# Altium project SpaceLiin_Satellite_4U_Laser_Internal_External_V1.0.0.PrjPcb
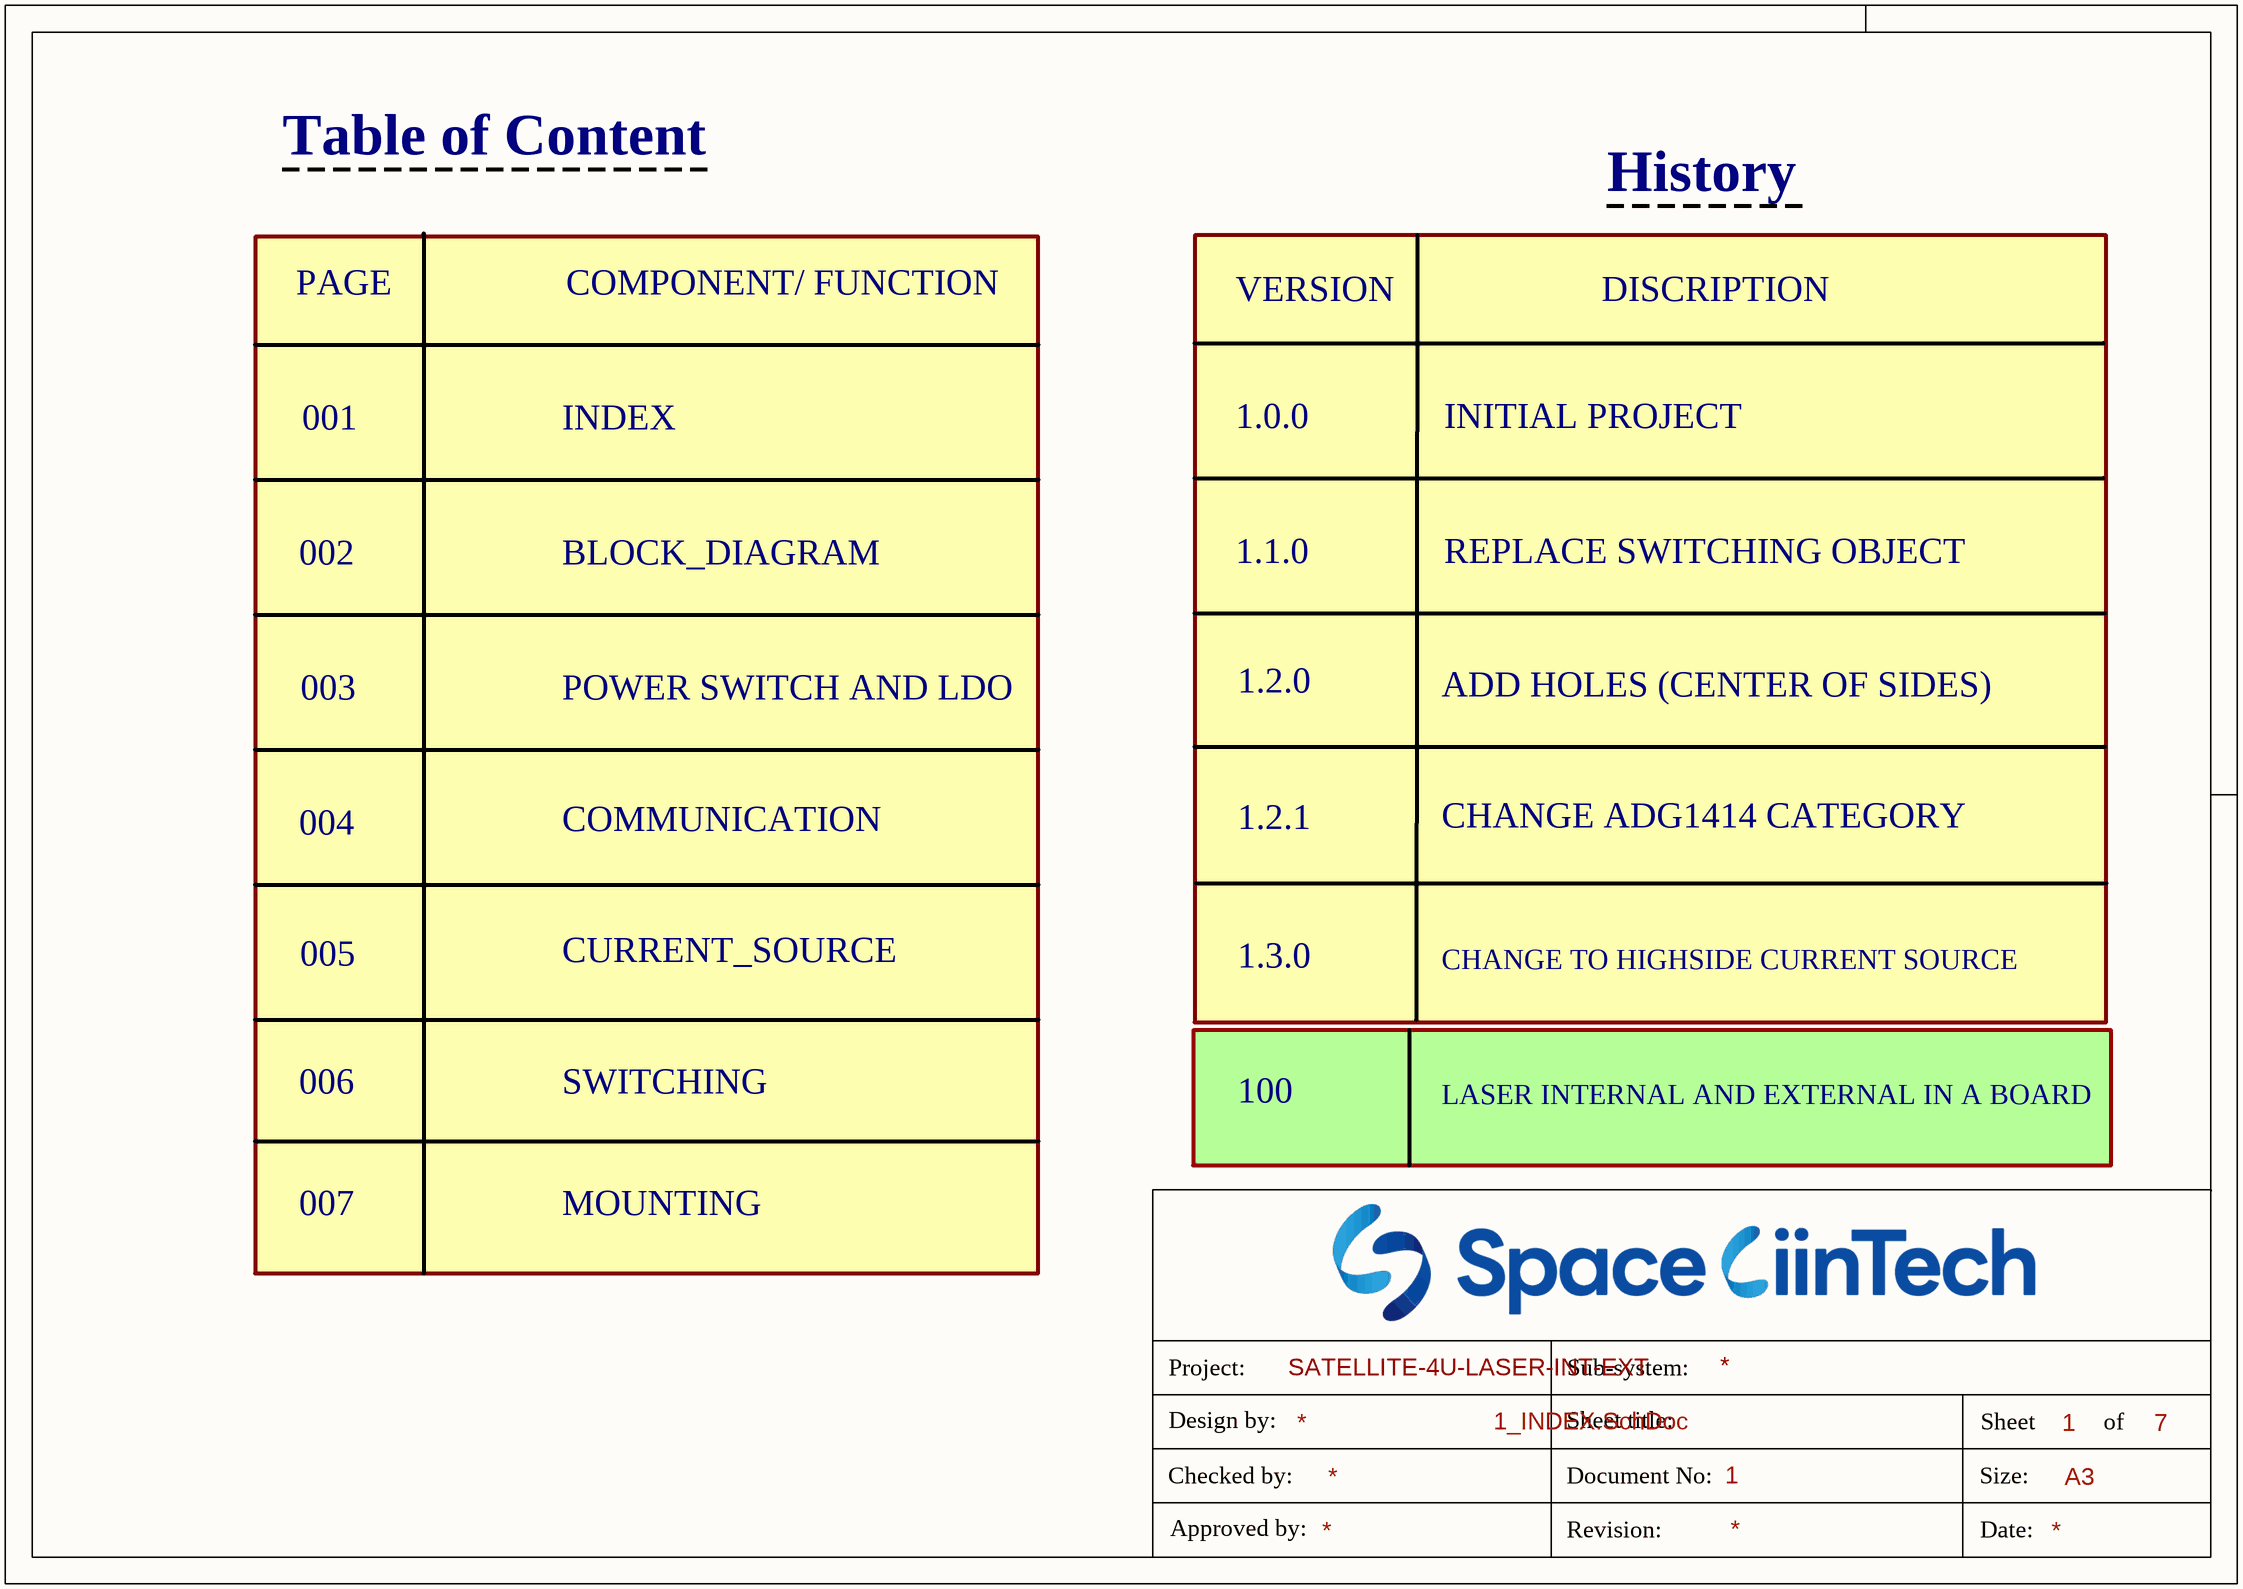
[diagram p0: 1_INDEX.SchDoc]
7 sheets, 210 parts. Net scope: global (net labels, ports and power ports of the same name join across sheets).
Board files: LASER.PcbDoc, SpaceLiin_Satellite_4U_Laser_Internal_External_V1.0.0.PcbDoc
Sheets:
  1_INDEX.SchDoc
  2_BLOCK_DIAGRAM.SchDoc
  3_POWER SWITCH AND LDO.SchDoc
  4_COMMUNICATION.SchDoc
  5_CURRENT_SOURCE.SchDoc
  6_SWITCHING.SchDoc
  MOUNTING.SchDoc

## Sheet 1_INDEX.SchDoc
size 420 x 297 mm; SheetNumber: 1; SheetTotal: 7; Project: SATELLITE-4U-LASER-INT-EXT

### Notes on the sheet
- Table of Content
- History
- PAGE
- COMPONENT/ FUNCTION
- VERSION
- DISCRIPTION
- 001
- INDEX
- 1.0.0
- INITIAL PROJECT
- 002
- BLOCK_DIAGRAM
- 1.1.0
- REPLACE SWITCHING OBJECT
- 003
- POWER SWITCH AND LDO
- 1.2.0
- ADD HOLES (CENTER OF SIDES)
- 004
- COMMUNICATION
- 1.2.1
- CHANGE ADG1414 CATEGORY
- 005
- CURRENT_SOURCE
- 1.3.0
- CHANGE TO HIGHSIDE CURRENT SOURCE
- 006
- SWITCHING
- 100
- LASER INTERNAL AND EXTERNAL IN A BOARD
- 007
- MOUNTING
- Project:
- Sub-system:
- Design by:
- Sheet title:
- Sheet
- A3
- of
- Checked by:
- Approved by:
- Revision:
- Document No:
- Size:
- Date:

## Sheet 2_BLOCK_DIAGRAM.SchDoc
size 420 x 297 mm; SheetNumber: 2; SheetTotal: 7

### Notes on the sheet
- Project:
- Sub-system:
- Design by:
- Sheet title:
- Sheet
- A3
- of
- Checked by:
- Approved by:
- Revision:
- Document No:
- Size:
- Date:

## Sheet 3_POWER SWITCH AND LDO.SchDoc
size 420 x 297 mm; SheetNumber: 3; SheetTotal: 7
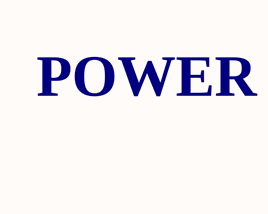
[diagram p1: 3_POWER SWITCH AND LDO.SchDoc, top left]
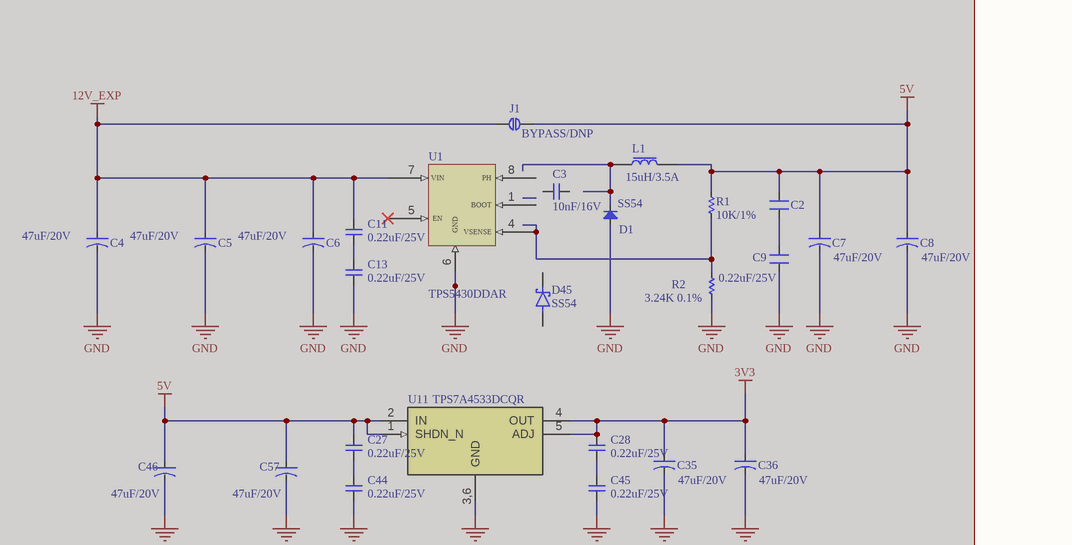
[diagram p2: 3_POWER SWITCH AND LDO.SchDoc, top right]
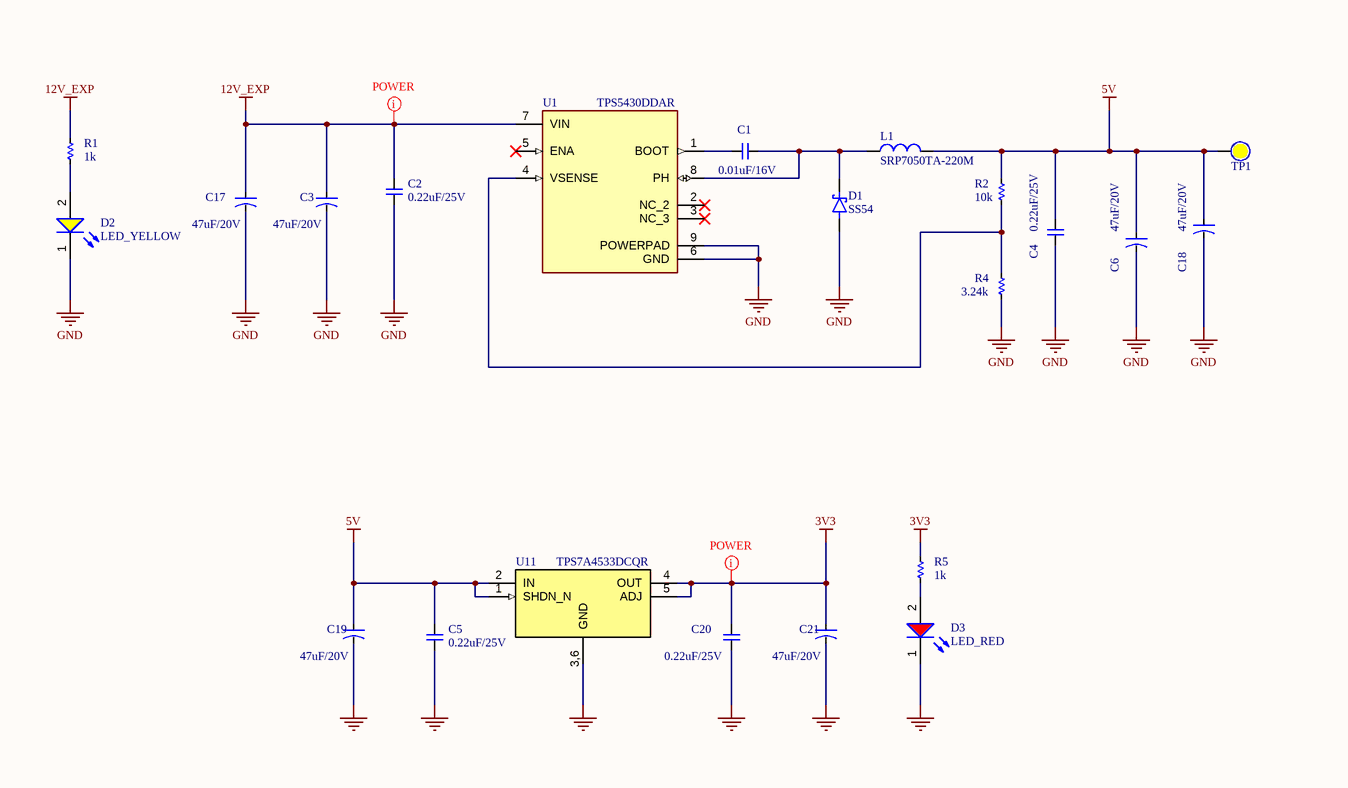
[diagram p3: 3_POWER SWITCH AND LDO.SchDoc, bottom right]

### Parts
(Parts that share a designator on the sheet are numbered #1, #2 ... from top to bottom, then left to right.)
C1  0.01uF/16V  [CAP_C_1608X80]
C2#1  0.22uF/25V  [SM-0603]  (value not drawn)  (masked out: inside a compile mask, not in the netlist)
C2#2  0.22uF/25V  [CAP_C_1608X80]
C3#1  10nF/16V  [CAP_C_1608X80]  (masked out: inside a compile mask, not in the netlist)
C3#2  47uF/20V  [CAP TANT 2312]
C4#1  47uF/20V  [CAP TANT 2312]  (masked out: inside a compile mask, not in the netlist)
C4#2  0.22uF/25V  [CAP_C_1608X80]
C5#1  47uF/20V  [CAP TANT 2312]  (masked out: inside a compile mask, not in the netlist)
C5#2  0.22uF/25V  [CAP_C_1608X80]
C6#1  47uF/20V  [CAP TANT 2312]  (masked out: inside a compile mask, not in the netlist)
C6#2  47uF/20V  [CAP TANT 2312]
C7  47uF/20V  [CAP TANT 2312]  (masked out: inside a compile mask, not in the netlist)
C8  47uF/20V  [CAP TANT 2312]  (masked out: inside a compile mask, not in the netlist)
C9#1  0.22uF/25V  [SM-0603]  (masked out: inside a compile mask, not in the netlist)
C11  0.22uF/25V  [CAP_C_1608X80]  (masked out: inside a compile mask, not in the netlist)
C13  0.22uF/25V  [CAP_C_1608X80]  (masked out: inside a compile mask, not in the netlist)
C17  47uF/20V  [CAP TANT 2312]
C18  47uF/20V  [CAP TANT 2312]
C19  47uF/20V  [CAP TANT 2312]
C20  0.22uF/25V  [CAP_C_1608X80]
C21  47uF/20V  [CAP TANT 2312]
C27  0.22uF/25V  [CAP_C_1608X80]  (masked out: inside a compile mask, not in the netlist)
C28  0.22uF/25V  [CAP_C_1608X80]  (masked out: inside a compile mask, not in the netlist)
C35  47uF/20V  [CAP TANT 2312]  (masked out: inside a compile mask, not in the netlist)
C36  47uF/20V  [CAP TANT 2312]  (masked out: inside a compile mask, not in the netlist)
C44  0.22uF/25V  [CAP_C_1608X80]  (masked out: inside a compile mask, not in the netlist)
C45  0.22uF/25V  [CAP_C_1608X80]  (masked out: inside a compile mask, not in the netlist)
C46  47uF/20V  [CAP TANT 2312]  (masked out: inside a compile mask, not in the netlist)
C57  47uF/20V  [CAP TANT 2312]  (masked out: inside a compile mask, not in the netlist)
D1#1  SS54  [DIO-SMD-A]  (masked out: inside a compile mask, not in the netlist)
D1#2  SS54  [DO-214AC_SMA]
D2  LED_YELLOW  [LED_0603]
D3  LED_RED  [LED_0603]
D45  SS54  [DO-214AC_SMA]  (masked out: inside a compile mask, not in the netlist)
J1#1  BYPASS/DNP  [BIG_CONNECTOR]  (masked out: inside a compile mask, not in the netlist)
L1#1  15uH/3.5A  [SRP7050TA]  (masked out: inside a compile mask, not in the netlist)
L1#2  SRP7050TA-220M  [PSM6050]
R1#1  10K/1%  [RES-SMD-0603]  (masked out: inside a compile mask, not in the netlist)
R1#2  1k  [RES_C_1005X40]
R2#1  3.24K 0.1%  [RES-SMD-0603]  (masked out: inside a compile mask, not in the netlist)
R2#2  10k  [RES_C_1005X40]
R4  3.24k  [RES_C_1005X40]
R5  1k  [RES_C_1005X40]
TP1  (no value)  [Testpoint_80]  (no BOM)
U1#1  TPS5430DDAR  [HSOP8]  (masked out: inside a compile mask, not in the netlist)
U1#2  TPS5430DDAR  [CONV_TPS5430DDAR]
U11#1  TPS7A4533DCQR  [SOT223-6]  (masked out: inside a compile mask, not in the netlist)
U11#2  TPS7A4533DCQR  [SOT223-6]

### Nets
3V3: C20.2 C21.1 R5.2 U11#2.4(OUT) U11#2.5(ADJ)
5V: C4#2.2 C5#2.2 C6#2.1 C18.1 C19.1 L1#2.2 R2#2.2 TP1.1 U11#2.1(SHDN_N) U11#2.2(IN)
12V_EXP: C2#2.2 C3#2.1 C17.1 R1#2.2 U1#2.7(VIN)
GND: C2#2.1 C3#2.2 C4#2.1 C5#2.1 C6#2.2 C17.2 C18.2 C19.2 C20.1 C21.2 D1#2.2(A) D2.1(K) D3.1(K) R4.1 U1#2.6(GND) U1#2.9(POWERPAD) U11#2.3,6(GND)
NetC1_1: C1.1 D1#2.1(K) L1#2.1 U1#2.8(PH)
NetC1_2: C1.2 U1#2.1(BOOT)
NetD2_2: D2.2(A) R1#2.1
NetD3_2: D3.2(A) R5.1
NetR2#2_1: R2#2.1 R4.2 U1#2.4(VSENSE)

Not connected (* = marked no-connect by the designer): U1#2 2(NC_2)* 3(NC_3)* 5(ENA)*

### Layout directives
net class POWER: 3V3, 12V_EXP

### Notes on the sheet
- POWER SWITCH AND LDO
- Project:
- Sub-system:
- Design by:
- Sheet title:
- Sheet
- A3
- of
- Checked by:
- Approved by:
- Revision:
- Document No:
- Size:
- Date:

### Library data of the parts
C1 C2#2 C3#1 C4#2 C5#2 C11 C13 C20 C27 C28 C44 C45 = _CAP_C_2: CAP
C2#1 C9#1 = CM: CL10B224KA8NNNC; Value: 103
C3#2 C4#1 C5#1 C6#1 C6#2 C7 C8 C17-C19 C21 C35 C36 C46 C57 = CN-ALU-SMD: TAJC476K020RNJ; Published: 8-Jun-2000; LatestRevisionDate: 17-Jul-2002; LatestRevisionNote: Re-released for DXP Platform.; PackageReference: POLAR0.8; Publisher: Altium Limited
D1#1 = Diode SMD: Code - JEDEC: DO-214-AB; Value: 1N5007; Published: 8-Jun-2000; Revision: July-2002: Re-released for DXP Platform.; Publisher: Altium Limited
D1#2 D45 = DIODE SCHOTTKY
J1#1 = CNT: DNP
L1#1 = INDUCTOR: SRP7050TA-150M
L1#2 = SRP7050TA-220M: FIXED IND 22UH 2.5A 170 MOHM SMD
R1#1 = Res-SMD: ERJ-3EKF1002V; Manufacturer: Generic Components; Class: Passive; Published: 08/06/2000; Publisher: Altium Hobart Technology Centre
R1#2 R2#2 R4 R5 = _RES_B_2: RES
R2#1 = Res-SMD: ERJ-3EKF3241V; Manufacturer: Generic Components; Class: Passive; Published: 08/06/2000; Publisher: Altium Hobart Technology Centre
TP1 = Test Point: Solder: NF
U1#1 = TPS543X: pin to pad: 6>6+9
U1#2 = TPS5430DDAR: 5.5V to 36V Input, 3A, 500kHz Step-Down Converter; MF: Texas Instruments; Package: HSOIC-8 Texas Instruments; Check_prices: https://www.snapeda.com/parts/TPS5430DDAR/Texas+Instruments/view-part/?ref=eda; Value: *; Purchase-URL: https://pricing.snapeda.com/search/part/TPS5430DDAR/?ref=eda; Availability: In Stock; SnapEDA_Link: https://www.snapeda.com/parts/TPS5430DDAR/Texas+Instruments/view-part/?ref=snap; MP: TPS5430DDAR; Price: None

## Sheet 4_COMMUNICATION.SchDoc
size 420 x 297 mm; SheetNumber: 4; SheetTotal: 7
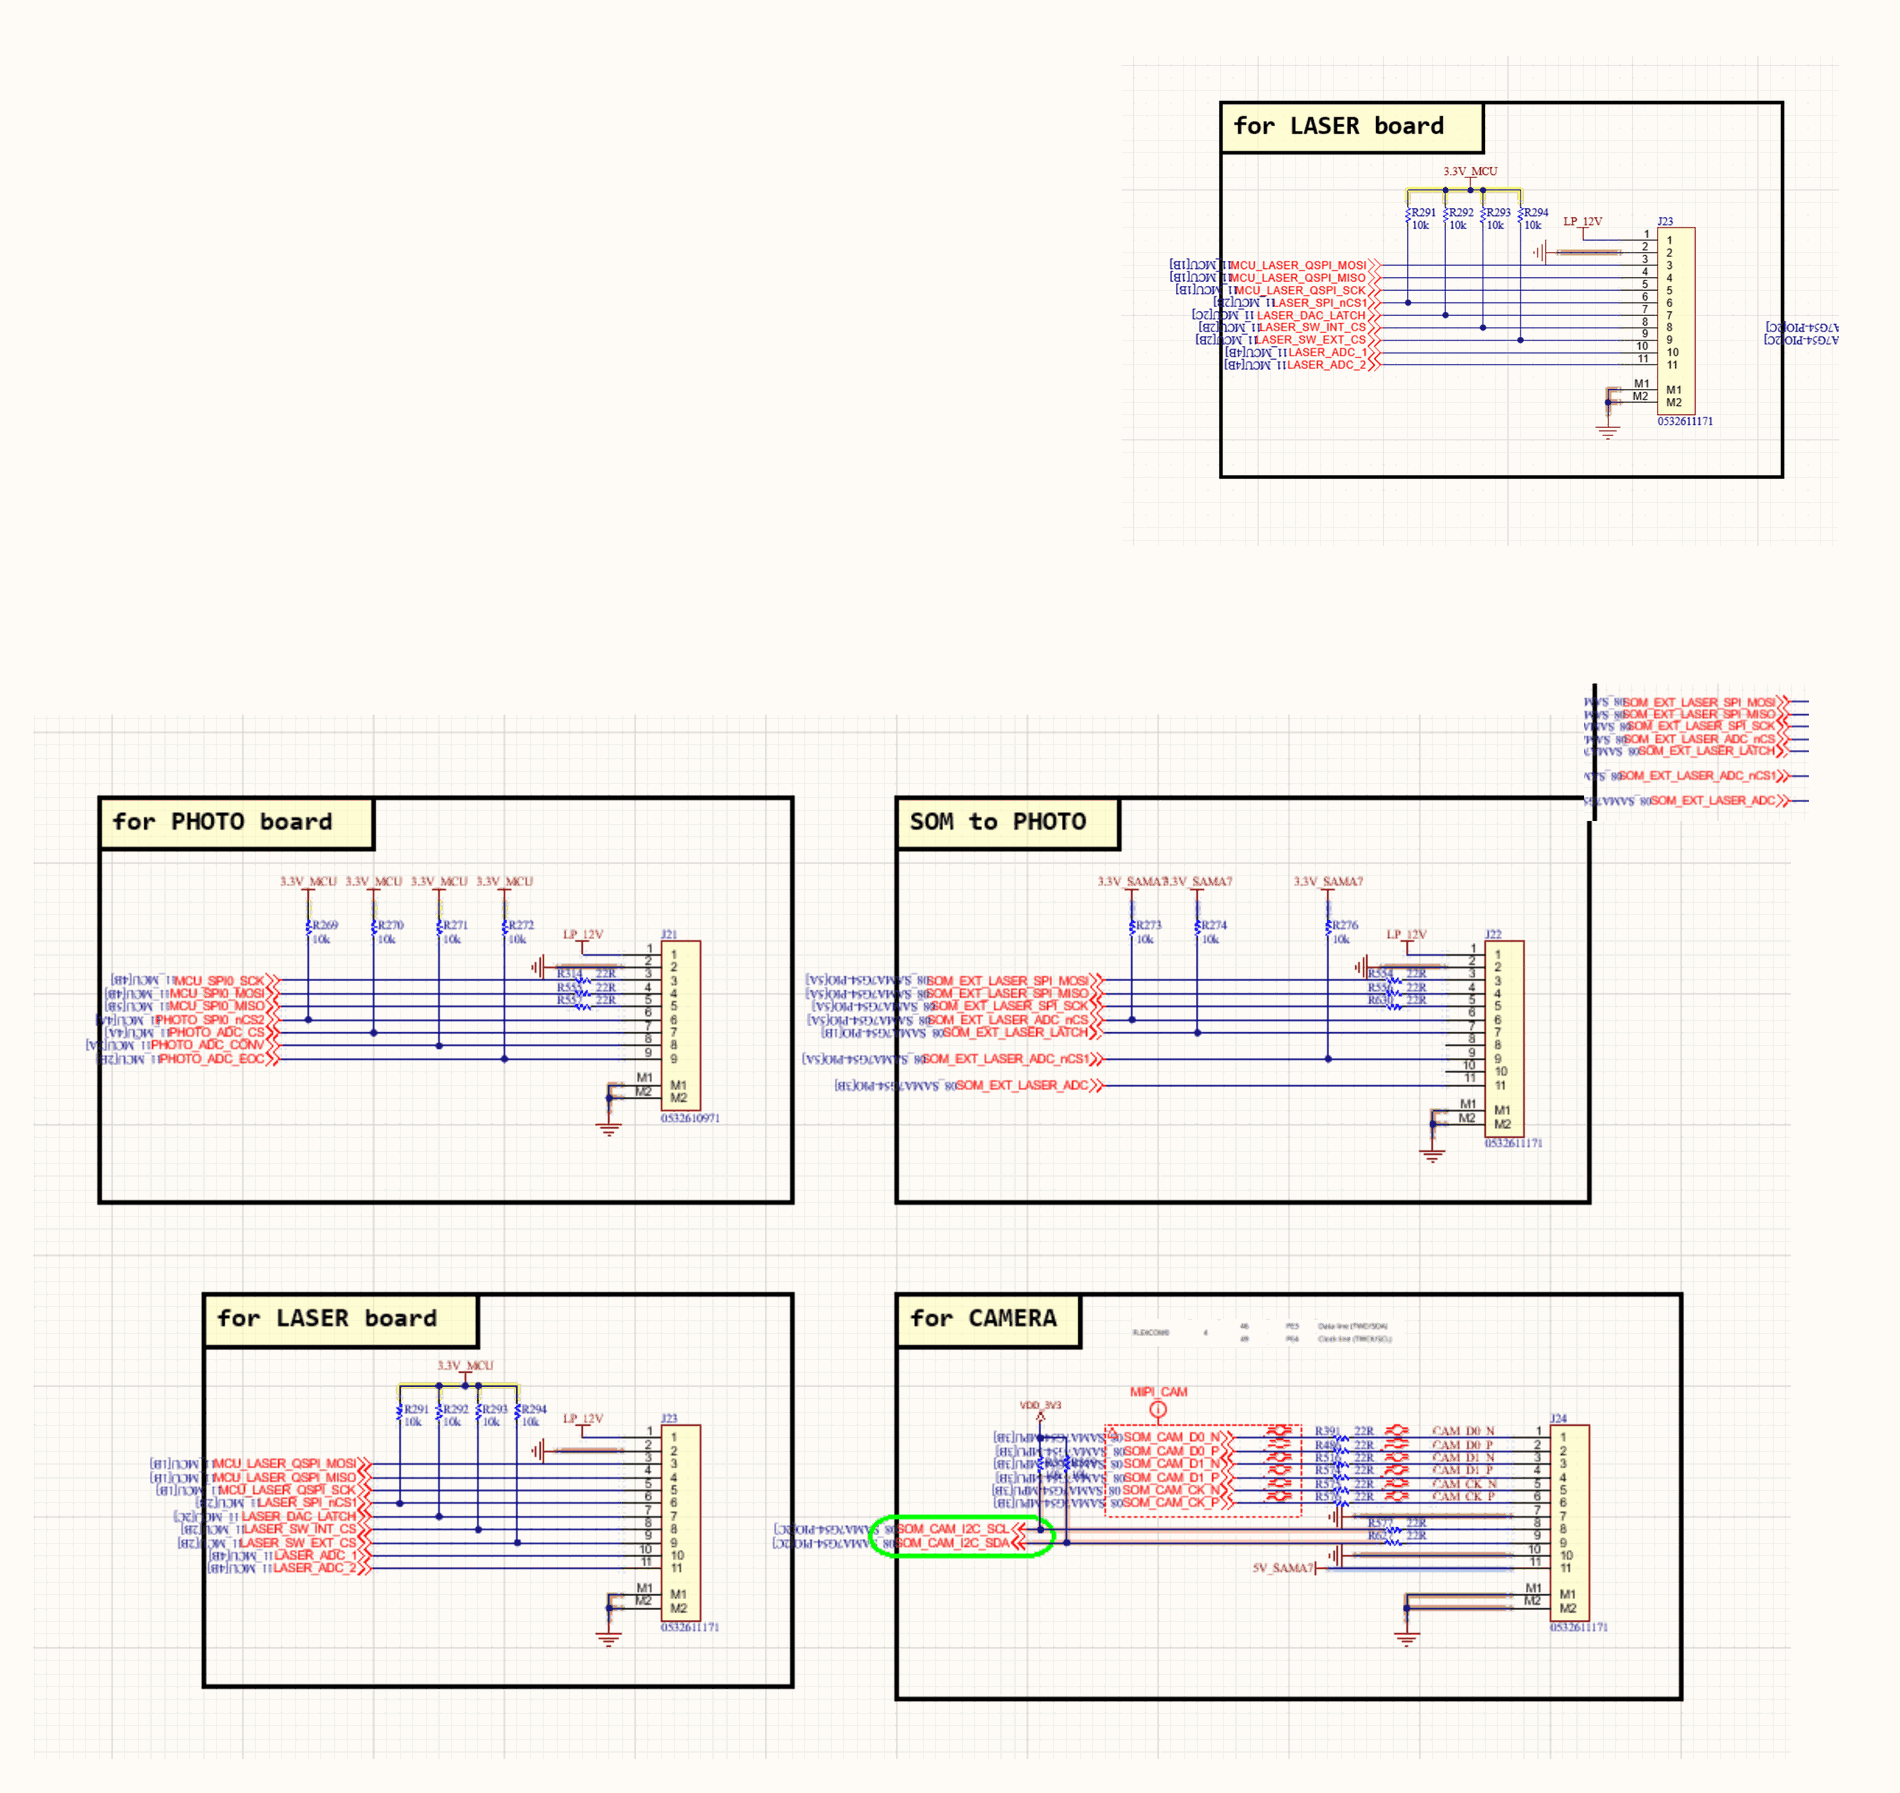
[diagram p4: 4_COMMUNICATION.SchDoc, left]
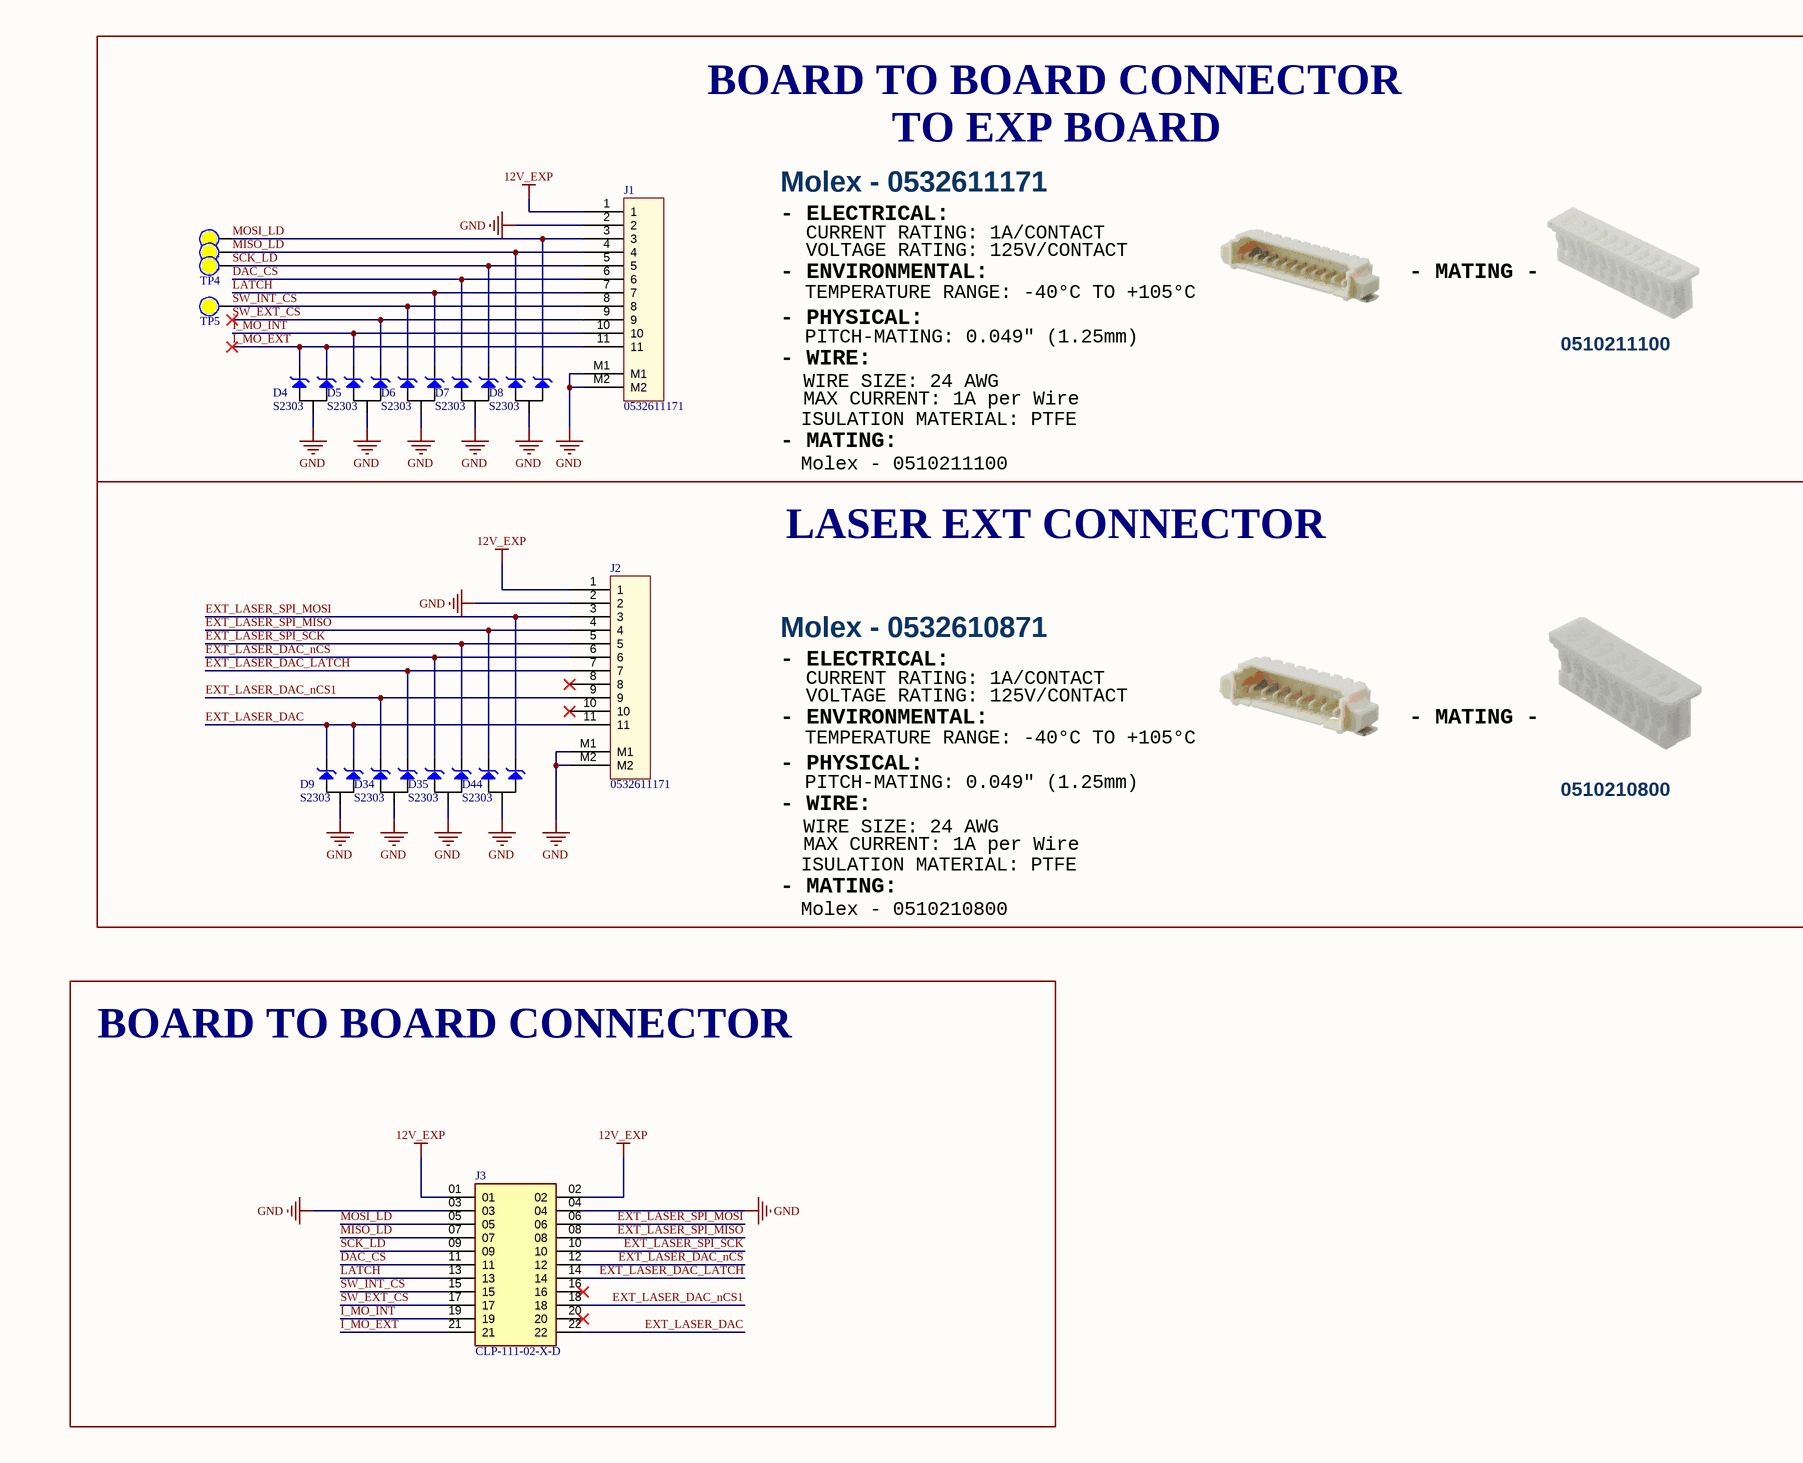
[diagram p5: 4_COMMUNICATION.SchDoc, right]

### Parts
(Parts that share a designator on the sheet are numbered #1, #2 ... from top to bottom, then left to right.)
D4  S2303  [SOT23-3-132]
D5  S2303  [SOT23-3-132]
D6  S2303  [SOT23-3-132]
D7  S2303  [SOT23-3-132]
D8  S2303  [SOT23-3-132]
D9  S2303  [SOT23-3-132]
D34  S2303  [SOT23-3-132]
D35  S2303  [SOT23-3-132]
D44  S2303  [SOT23-3-132]
J1#2  0532611171  [MOLEX_0532611171]
J2  0532611171  [MOLEX_0532611171]
J3  CLP-111-02-X-D  [SAMTEC_CLP-111-02-X-D]
TP2  (no value)  [Testpoint_80]  (no BOM)
TP3  (no value)  [Testpoint_80]  (no BOM)
TP4  (no value)  [Testpoint_80]  (no BOM)
TP5  (no value)  [Testpoint_80]  (no BOM)

### Blocks framed on the sheet
LASER EXT CONNECTOR: D9 D34 D35 D44 J2
BOARD TO BOARD CONNECTOR: J3

### Nets
12V_EXP: J1#2.1 J2.1 J3.01 J3.02
GND: D4.3 D5.3 D6.3 D7.3 D8.3 D9.3 D34.3 D35.3 D44.3 J1#2.2 J1#2.M1 J1#2.M2 J2.2 J2.M1 J2.M2 J3.03 J3.04
DAC_CS: D7.2 J1#2.6 J3.11
EXT_LASER_DAC: D9.1 D9.2 J2.11 J3.22
EXT_LASER_DAC_LATCH: D34.1 J2.7 J3.14
EXT_LASER_DAC_nCS: D35.2 J2.6 J3.12
EXT_LASER_DAC_nCS1: D34.2 J2.9 J3.18
EXT_LASER_SPI_MISO: D44.2 J2.4 J3.08
EXT_LASER_SPI_MOSI: D44.1 J2.3 J3.06
EXT_LASER_SPI_SCK: D35.1 J2.5 J3.10
I_MO_EXT: D4.1 D4.2 J1#2.11 J3.21
I_MO_INT: D5.2 J1#2.10 J3.19
LATCH: D6.1 J1#2.7 J3.13
MISO_LD: D8.2 J1#2.4 J3.07 TP3.1
MOSI_LD: D8.1 J1#2.3 J3.05 TP2.1
SCK_LD: D7.1 J1#2.5 J3.09 TP4.1
SW_EXT_CS: D5.1 J1#2.9 J3.17
SW_INT_CS: D6.2 J1#2.8 J3.15 TP5.1

Not connected (* = marked no-connect by the designer): J2 8* 10*; J3 16* 20*

### Notes on the sheet
- BOARD TO BOARD CONNECTOR
- Molex - 0532611171
- TO EXP BOARD
- - ELECTRICAL:
- - ENVIRONMENTAL:
- CURRENT RATING: 1A/CONTACT
- VOLTAGE RATING: 125V/CONTACT
- - MATING -
- - PHYSICAL:
- TEMPERATURE RANGE: -40°C TO +105°C
- PITCH-MATING: 0.049" (1.25mm)
- - WIRE:
- WIRE SIZE: 24 AWG
- MAX CURRENT: 1A per Wire
- 0510211100
- - MATING:
- ISULATION MATERIAL: PTFE
- Molex - 0510211100
- Molex - 0532610871
- 0510210800
- Molex - 0510210800
- Project:
- Sub-system:
- Design by:
- Sheet title:
- Sheet
- A3
- of
- Checked by:
- Approved by:
- Revision:
- Document No:
- Size:
- Date:

### Library data of the parts
J1#2 J2 = Header 11x1_2M
J3 = CLP-111-02-X-D: CLP - Samtec 1.27mm Tiger Claw Rugged Reliable Dual Wipe Socket Strip; MP: CLP-111-02-L-D; SnapEDA_Link: https://www.snapeda.com/parts/CLP-111-02-L-D/Samtec/view-part/?ref=snap; Package: None; Value: *; MF: Samtec; Check_prices: https://www.snapeda.com/parts/CLP-111-02-L-D/Samtec/view-part/?ref=eda
TP2-TP5 = Test Point: Solder: NF

## Sheet 5_CURRENT_SOURCE.SchDoc
size 420 x 297 mm; SheetNumber: 5; SheetTotal: 7
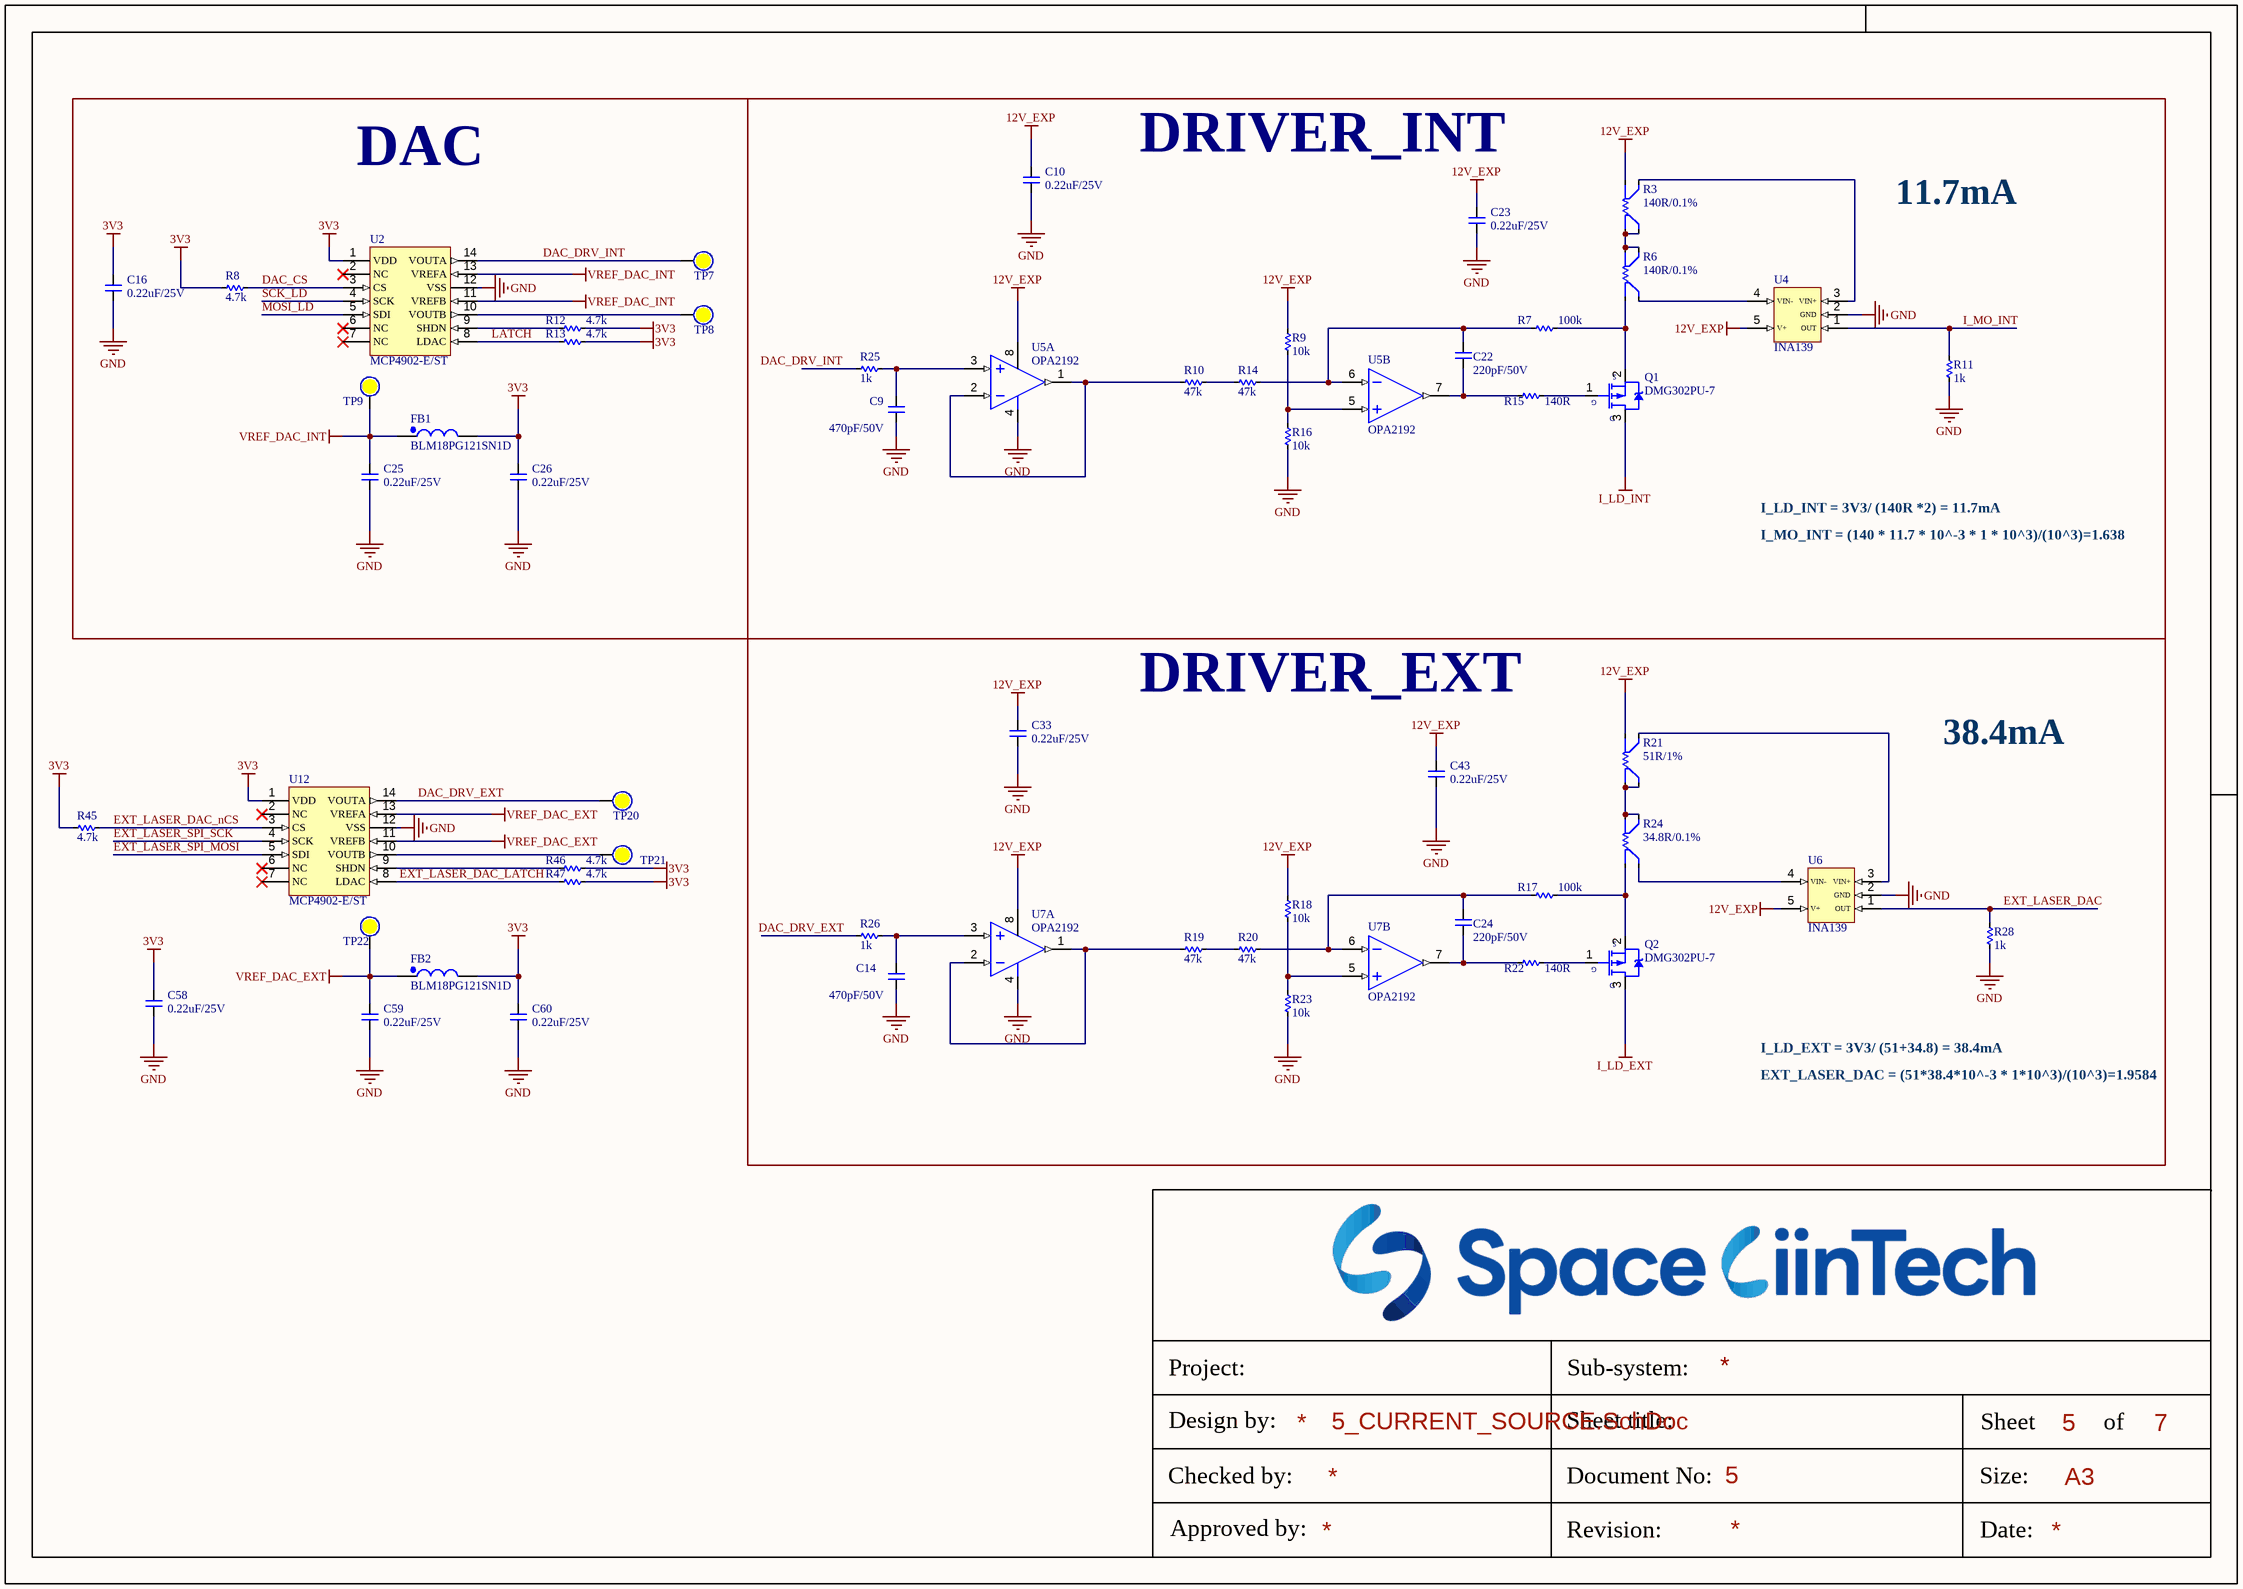
[diagram p6: 5_CURRENT_SOURCE.SchDoc]

### Parts
(Parts that share a designator on the sheet are numbered #1, #2 ... from top to bottom, then left to right.)
C9#2  470pF/50V  [CAP_C_1608X80]
C10  0.22uF/25V  [CAP_C_1608X80]
C14  470pF/50V  [CAP_C_1608X80]
C16  0.22uF/25V  [CAP_C_1608X80]
C22  220pF/50V  [CAP_C_1608X80]
C23  0.22uF/25V  [CAP_C_1608X80]
C24  220pF/50V  [CAP_C_1608X80]
C25  0.22uF/25V  [CAP_C_1608X80]
C26  0.22uF/25V  [CAP_C_1608X80]
C33  0.22uF/25V  [CAP_C_1608X80]
C43  0.22uF/25V  [CAP_C_1608X80]
C58  0.22uF/25V  [CAP_C_1608X80]
C59  0.22uF/25V  [CAP_C_1608X80]
C60  0.22uF/25V  [CAP_C_1608X80]
FB1  BLM18PG121SN1D  [IND_C_1608X60]
FB2  BLM18PG121SN1D  [IND_C_1608X60]
Q1  DMG302PU-7  [SOT23-3-132]
Q2  DMG302PU-7  [SOT23-3-132]
R3  140R/0.1%  [RES_SMD_0603_SHUNT]
R6  140R/0.1%  [RES_SMD_0603_SHUNT]
R7  100k  [RES_C_1608X60]
R8  4.7k  [RES_C_1608X60]
R9  10k  [RES_C_1608X60]
R10  47k  [RES_C_1608X60]
R11  1k  [RES_C_1608X60]
R12  4.7k  [RES_C_1608X60]
R13  4.7k  [RES_C_1608X60]
R14  47k  [RES_C_1608X60]
R15  140R  [RES_C_1608X60]
R16  10k  [RES_C_1608X60]
R17  100k  [RES_C_1608X60]
R18  10k  [RES_C_1608X60]
R19  47k  [RES_C_1608X60]
R20  47k  [RES_C_1608X60]
R21  51R/1%  [RES_SMD_0603_SHUNT]
R22  140R  [RES_C_1608X60]
R23  10k  [RES_C_1608X60]
R24  34.8R/0.1%  [RES_SMD_0603_SHUNT]
R25  1k  [RES_C_1608X60]
R26  1k  [RES_C_1608X60]
R28  1k  [RES_C_1608X60]
R45  4.7k  [RES_C_1608X60]
R46  4.7k  [RES_C_1608X60]
R47  4.7k  [RES_C_1608X60]
TP7  (no value)  [Testpoint_80]  (no BOM)
TP8  (no value)  [Testpoint_80]  (no BOM)
TP9  (no value)  [Testpoint_80]  (no BOM)
TP20  (no value)  [Testpoint_80]  (no BOM)
TP21  (no value)  [Testpoint_80]  (no BOM)
TP22  (no value)  [Testpoint_80]  (no BOM)
U2  MCP4902-E/ST  [TSSOP14]
U4  INA139  [SOT23-5]
U5  OPA2192  [SO8]  (parts A,B of 2)
U6  INA139  [SOT23-5]
U7  OPA2192  [SO8]  (parts A,B of 2)
U12  MCP4902-E/ST  [TSSOP14]

### Blocks framed on the sheet
DAC: C16 C25 C26 FB1 R8 R12 R13 TP7-TP9 U2
DRIVER_INT: C9#2 C10 C22 C23 Q1 R3 R6 R7 R9-R11 R14-R16 R25 U4 U5
DRIVER_EXT: C14 C24 C33 C43 Q2 R17-R24 R26 R28 U6 U7

### Nets
3V3: C16.2 C26.2 C58.2 C60.2 FB1.2 FB2.2 R8.1 R12.2 R13.2 R45.1 R46.2 R47.2 U2.1(VDD) U12.1(VDD)
12V_EXP: C10.2 C23.2 C33.2 C43.2 R3.1 R9.1 R18.1 R21.1 U4.5(V+) U5.8(+V) U6.5(V+) U7.8(+V)
GND: C9#2.1 C10.1 C14.1 C16.1 C23.1 C25.1 C26.1 C33.1 C43.1 C58.1 C59.1 C60.1 R11.2 R16.2 R23.2 R28.2 U2.12(VSS) U4.2(GND) U5.4(-V) U6.2(GND) U7.4(-V) U12.12(VSS)
I_LD_EXT: Q2.3(D)
I_LD_INT: Q1.3(D)
VREF_DAC_EXT: C59.2 FB2.1 TP22.1 U12.11(VREFB) U12.13(VREFA)
VREF_DAC_INT: C25.2 FB1.1 TP9.1 U2.11(VREFB) U2.13(VREFA)
DAC_CS: R8.2 U2.3(CS)
DAC_DRV_EXT: R26.1 TP20.1 U12.14(VOUTA)
DAC_DRV_INT: R25.1 TP7.1 U2.14(VOUTA)
EXT_LASER_DAC: R28.1 U6.1(OUT)
EXT_LASER_DAC_LATCH: R47.1 U12.8(LDAC)
EXT_LASER_DAC_nCS: R45.2 U12.3(CS)
EXT_LASER_SPI_MOSI: U12.5(SDI)
EXT_LASER_SPI_SCK: U12.4(SCK)
I_MO_INT: R11.1 U4.1(OUT)
LATCH: R13.1 U2.8(LDAC)
MOSI_LD: U2.5(SDI)
SCK_LD: U2.4(SCK)
NetC9#2_2: C9#2.2 R25.2 U5.3(IN+)
NetC14_2: C14.2 R26.2 U7.3(IN+)
NetC22_1: C22.1 R7.1 R14.2 U5.6(IN-)
NetC22_2: C22.2 R15.1 U5.7(OUT)
NetC24_1: C24.1 R17.1 R20.2 U7.6(IN-)
NetC24_2: C24.2 R22.1 U7.7(OUT)
NetQ1_1: Q1.1(G) R15.2
NetQ1_2: Q1.2(S) R6.2 R7.2
NetQ2_1: Q2.1(G) R22.2
NetQ2_2: Q2.2(S) R17.2 R24.2
NetR3_2: R3.2 R3.4 R6.1 R6.3
NetR3_3: R3.3 U4.3(VIN+)
NetR6_4: R6.4 U4.4(VIN-)
NetR9_2: R9.2 R16.1 U5.5(IN+)
NetR10_1: R10.1 U5.1(OUT) U5.2(IN-)
NetR10_2: R10.2 R14.1
NetR12_1: R12.1 U2.9(SHDN)
NetR18_2: R18.2 R23.1 U7.5(IN+)
NetR19_1: R19.1 U7.1(OUT) U7.2(IN-)
NetR19_2: R19.2 R20.1
NetR21_2: R21.2 R21.4 R24.1 R24.3
NetR21_3: R21.3 U6.3(VIN+)
NetR24_4: R24.4 U6.4(VIN-)
NetR46_1: R46.1 U12.9(SHDN)
NetTP8_1: TP8.1 U2.10(VOUTB)
NetTP21_1: TP21.1 U12.10(VOUTB)

Not connected (* = marked no-connect by the designer): U2 2(NC)* 6(NC)* 7(NC)*; U12 2(NC)* 6(NC)* 7(NC)*

### Notes on the sheet
- 11.7mA
- I_LD_INT = 3V3/ (140R *2) = 11.7mA
- I_MO_INT = (140 * 11.7 * 10^-3 * 1 * 10^3)/(10^3)=1.638
- 38.4mA
- I_LD_EXT = 3V3/ (51+34.8) = 38.4mA
- EXT_LASER_DAC = (51*38.4*10^-3 * 1*10^3)/(10^3)=1.9584
- Project:
- Sub-system:
- Design by:
- Sheet title:
- Sheet
- A3
- of
- Checked by:
- Approved by:
- Revision:
- Document No:
- Size:
- Date:

### Library data of the parts
C9#2 C10 C14 C16 C22-C26 C33 C43 C58-C60 = _CAP_C_2: CAP
FB1 FB2 = _IND
Q1 Q2 = P_MOSFET
R3 R6 = RES_SMD_SHUNT: RN73R1JTTD30R0B25
R7-R20 R22 R23 R25 R26 R28 R45-R47 = _RES_B_2: RES
R21 R24 = RES_SMD_SHUNT: RT0603BRD077R5L
TP7-TP9 TP20-TP22 = Test Point: Solder: NF
U2 U12 = MCP4902
U4 U6 = INA139: INA139NA/250
U5 U7 = LM358: OPA2192IDR; Value: LM358

## Sheet 6_SWITCHING.SchDoc
size 420 x 297 mm; SheetNumber: 6; SheetTotal: 7
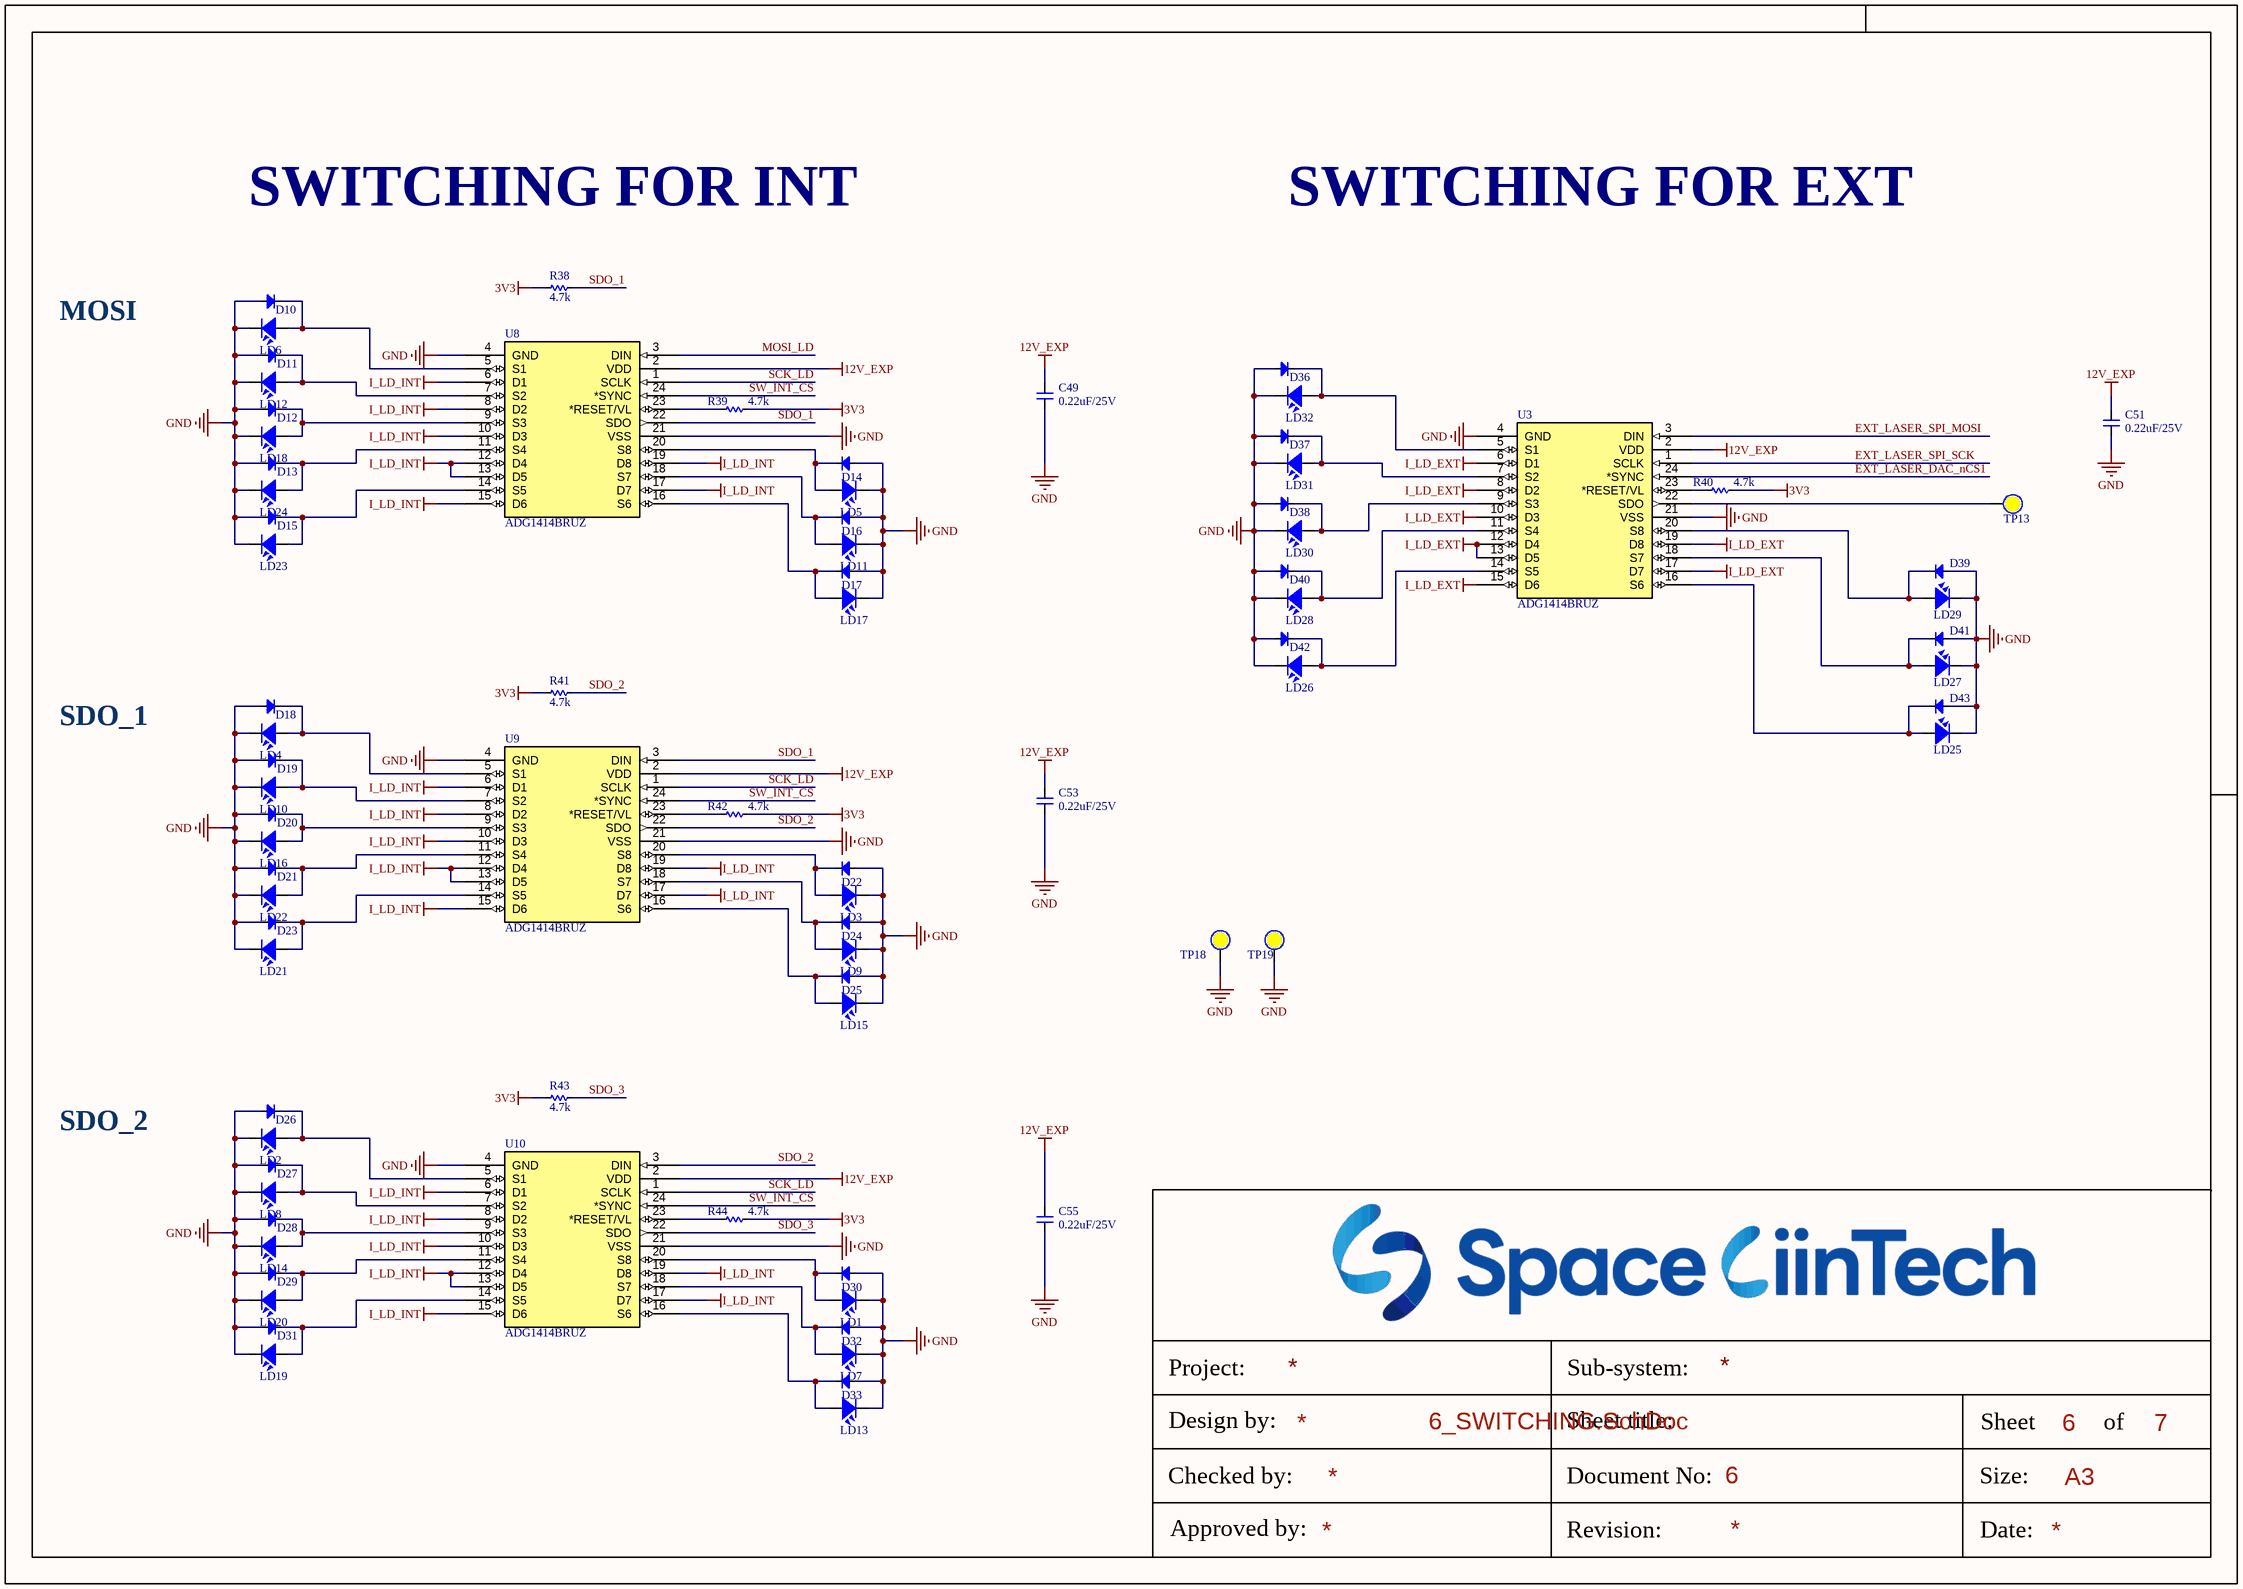
[diagram p7: 6_SWITCHING.SchDoc]

### Parts
C49  0.22uF/25V  [CAP_C_1608X80]
C51  0.22uF/25V  [CAP_C_1608X80]
C53  0.22uF/25V  [CAP_C_1608X80]
C55  0.22uF/25V  [CAP_C_1608X80]
D10  1N4148W-TP  [SOD23]  (value not drawn)
D11  1N4148W-TP  [SOD23]  (value not drawn)
D12  1N4148W-TP  [SOD23]  (value not drawn)
D13  1N4148W-TP  [SOD23]  (value not drawn)
D14  1N4148W-TP  [SOD23]  (value not drawn)
D15  1N4148W-TP  [SOD23]  (value not drawn)
D16  1N4148W-TP  [SOD23]  (value not drawn)
D17  1N4148W-TP  [SOD23]  (value not drawn)
D18  1N4148W-TP  [SOD23]  (value not drawn)
D19  1N4148W-TP  [SOD23]  (value not drawn)
D20  1N4148W-TP  [SOD23]  (value not drawn)
D21  1N4148W-TP  [SOD23]  (value not drawn)
D22  1N4148W-TP  [SOD23]  (value not drawn)
D23  1N4148W-TP  [SOD23]  (value not drawn)
D24  1N4148W-TP  [SOD23]  (value not drawn)
D25  1N4148W-TP  [SOD23]  (value not drawn)
D26  1N4148W-TP  [SOD23]  (value not drawn)
D27  1N4148W-TP  [SOD23]  (value not drawn)
D28  1N4148W-TP  [SOD23]  (value not drawn)
D29  1N4148W-TP  [SOD23]  (value not drawn)
D30  1N4148W-TP  [SOD23]  (value not drawn)
D31  1N4148W-TP  [SOD23]  (value not drawn)
D32  1N4148W-TP  [SOD23]  (value not drawn)
D33  1N4148W-TP  [SOD23]  (value not drawn)
D36  1N4148W-TP  [SOD23]  (value not drawn)
D37  1N4148W-TP  [SOD23]  (value not drawn)
D38  1N4148W-TP  [SOD23]  (value not drawn)
D39  1N4148W-TP  [SOD23]  (value not drawn)
D40  1N4148W-TP  [SOD23]  (value not drawn)
D41  1N4148W-TP  [SOD23]  (value not drawn)
D42  1N4148W-TP  [SOD23]  (value not drawn)
D43  1N4148W-TP  [SOD23]  (value not drawn)
LD1  LaserDiode  [OPV302]  (value not drawn)
LD2  LaserDiode  [OPV302]  (value not drawn)
LD3  LaserDiode  [OPV302]  (value not drawn)
LD4  LaserDiode  [OPV302]  (value not drawn)
LD5  LaserDiode  [OPV302]  (value not drawn)
LD6  LaserDiode  [OPV302]  (value not drawn)
LD7  LaserDiode  [OPV302]  (value not drawn)
LD8  LaserDiode  [OPV302]  (value not drawn)
LD9  LaserDiode  [OPV302]  (value not drawn)
LD10  LaserDiode  [OPV302]  (value not drawn)
LD11  LaserDiode  [OPV302]  (value not drawn)
LD12  LaserDiode  [OPV302]  (value not drawn)
LD13  LaserDiode  [OPV302]  (value not drawn)
LD14  LaserDiode  [OPV302]  (value not drawn)
LD15  LaserDiode  [OPV302]  (value not drawn)
LD16  LaserDiode  [OPV302]  (value not drawn)
LD17  LaserDiode  [OPV302]  (value not drawn)
LD18  LaserDiode  [OPV302]  (value not drawn)
LD19  LaserDiode  [OPV302]  (value not drawn)
LD20  LaserDiode  [OPV302]  (value not drawn)
LD21  LaserDiode  [OPV302]  (value not drawn)
LD22  LaserDiode  [OPV302]  (value not drawn)
LD23  LaserDiode  [OPV302]  (value not drawn)
LD24  LaserDiode  [OPV302]  (value not drawn)
LD25  LaserDiode  [RLD65NZX1]  (value not drawn)
LD26  LaserDiode  [RLD65NZX1]  (value not drawn)
LD27  LaserDiode  [RLD65NZX1]  (value not drawn)
LD28  LaserDiode  [RLD65NZX1]  (value not drawn)
LD29  LaserDiode  [RLD65NZX1]  (value not drawn)
LD30  LaserDiode  [RLD65NZX1]  (value not drawn)
LD31  LaserDiode  [RLD65NZX1]  (value not drawn)
LD32  LaserDiode  [RLD65NZX1]  (value not drawn)
R38  4.7k  [RES_C_1608X60]
R39  4.7k  [RES_C_1608X60]
R40  4.7k  [RES_C_1608X60]
R41  4.7k  [RES_C_1608X60]
R42  4.7k  [RES_C_1608X60]
R43  4.7k  [RES_C_1608X60]
R44  4.7k  [RES_C_1608X60]
TP13  (no value)  [Testpoint_80]  (no BOM)
TP18  (no value)  [Testpoint_80]  (no BOM)
TP19  (no value)  [Testpoint_80]  (no BOM)
U3  ADG1414BRUZ  [TSSOP24]
U8  ADG1414BRUZ  [TSSOP24]
U9  ADG1414BRUZ  [TSSOP24]
U10  ADG1414BRUZ  [TSSOP24]

### Nets
3V3: R38.1 R39.2 R40.2 R41.1 R42.2 R43.1 R44.2
12V_EXP: C49.2 C51.2 C53.2 C55.2 U3.2(VDD) U8.2(VDD) U9.2(VDD) U10.2(VDD)
GND: C49.1 C51.1 C53.1 C55.1 D10.1(A) D11.1(A) D12.1(A) D13.1(A) D14.1(A) D15.1(A) D16.1(A) D17.1(A) D18.1(A) D19.1(A) D20.1(A) D21.1(A) D22.1(A) D23.1(A) D24.1(A) D25.1(A) D26.1(A) D27.1(A) D28.1(A) D29.1(A) D30.1(A) D31.1(A) D32.1(A) D33.1(A) D36.1(A) D37.1(A) D38.1(A) D39.1(A) D40.1(A) D41.1(A) D42.1(A) D43.1(A) LD1.2 LD2.2 LD3.2 LD4.2 LD5.2 LD6.2 LD7.2 LD8.2 LD9.2 LD10.2 LD11.2 LD12.2 LD13.2 LD14.2 LD15.2 LD16.2 LD17.2 LD18.2 LD19.2 LD20.2 LD21.2 LD22.2 LD23.2 LD24.2 LD25.1 LD26.1 LD27.1 LD28.1 LD29.1 LD30.1 LD31.1 LD32.1 TP18.1 TP19.1 U3.4(GND) U3.21(VSS) U8.4(GND) U8.21(VSS) U9.4(GND) U9.21(VSS) U10.4(GND) U10.21(VSS)
I_LD_EXT: U3.6(D1) U3.8(D2) U3.10(D3) U3.12(D4) U3.13(D5) U3.15(D6) U3.17(D7) U3.19(D8)
I_LD_INT: U8.6(D1) U8.8(D2) U8.10(D3) U8.12(D4) U8.13(D5) U8.15(D6) U8.17(D7) U8.19(D8) U9.6(D1) U9.8(D2) U9.10(D3) U9.12(D4) U9.13(D5) U9.15(D6) U9.17(D7) U9.19(D8) U10.6(D1) U10.8(D2) U10.10(D3) U10.12(D4) U10.13(D5) U10.15(D6) U10.17(D7) U10.19(D8)
EXT_LASER_DAC_nCS1: U3.24(*SYNC)
EXT_LASER_SPI_MOSI: U3.3(DIN)
EXT_LASER_SPI_SCK: U3.1(SCLK)
MOSI_LD: U8.3(DIN)
SCK_LD: U8.1(SCLK) U9.1(SCLK) U10.1(SCLK)
SDO_1: R38.2 U8.22(SDO) U9.3(DIN)
SDO_2: R41.2 U9.22(SDO) U10.3(DIN)
SDO_3: R43.2 U10.22(SDO)
SW_INT_CS: U8.24(*SYNC) U9.24(*SYNC) U10.24(*SYNC)
NetD10_2: D10.2(K) LD6.1 U8.5(S1)
NetD11_2: D11.2(K) LD12.1 U8.7(S2)
NetD12_2: D12.2(K) LD18.1 U8.9(S3)
NetD13_2: D13.2(K) LD24.1 U8.11(S4)
NetD14_2: D14.2(K) LD5.1 U8.20(S8)
NetD15_2: D15.2(K) LD23.1 U8.14(S5)
NetD16_2: D16.2(K) LD11.1 U8.18(S7)
NetD17_2: D17.2(K) LD17.1 U8.16(S6)
NetD18_2: D18.2(K) LD4.1 U9.5(S1)
NetD19_2: D19.2(K) LD10.1 U9.7(S2)
NetD20_2: D20.2(K) LD16.1 U9.9(S3)
NetD21_2: D21.2(K) LD22.1 U9.11(S4)
NetD22_2: D22.2(K) LD3.1 U9.20(S8)
NetD23_2: D23.2(K) LD21.1 U9.14(S5)
NetD24_2: D24.2(K) LD9.1 U9.18(S7)
NetD25_2: D25.2(K) LD15.1 U9.16(S6)
NetD26_2: D26.2(K) LD2.1 U10.5(S1)
NetD27_2: D27.2(K) LD8.1 U10.7(S2)
NetD28_2: D28.2(K) LD14.1 U10.9(S3)
NetD29_2: D29.2(K) LD20.1 U10.11(S4)
NetD30_2: D30.2(K) LD1.1 U10.20(S8)
NetD31_2: D31.2(K) LD19.1 U10.14(S5)
NetD32_2: D32.2(K) LD7.1 U10.18(S7)
NetD33_2: D33.2(K) LD13.1 U10.16(S6)
NetD36_2: D36.2(K) LD32.3 U3.5(S1)
NetD37_2: D37.2(K) LD31.3 U3.7(S2)
NetD38_2: D38.2(K) LD30.3 U3.9(S3)
NetD39_2: D39.2(K) LD29.3 U3.20(S8)
NetD40_2: D40.2(K) LD28.3 U3.11(S4)
NetD41_2: D41.2(K) LD27.3 U3.18(S7)
NetD42_2: D42.2(K) LD26.3 U3.14(S5)
NetD43_2: D43.2(K) LD25.3 U3.16(S6)
NetR39_1: R39.1 U8.23(*RESET/VL)
NetR40_1: R40.1 U3.23(*RESET/VL)
NetR42_1: R42.1 U9.23(*RESET/VL)
NetR44_1: R44.1 U10.23(*RESET/VL)
NetTP13_1: TP13.1 U3.22(SDO)

### Notes on the sheet
- SWITCHING FOR INT
- SWITCHING FOR EXT
- MOSI
- SDO_1
- SDO_2
- Project:
- Sub-system:
- Design by:
- Sheet title:
- Sheet
- A3
- of
- Checked by:
- Approved by:
- Revision:
- Document No:
- Size:
- Date:

### Library data of the parts
C49 C51 C53 C55 = _CAP_C_2: CAP
D10-D33 D36-D43 = Diode SMD: Code - JEDEC: DO-214-AB; Value: 1N5007; Published: 8-Jun-2000; Revision: July-2002: Re-released for DXP Platform.; Publisher: Altium Limited
LD1-LD24 = LD: OPV302
LD25-LD32 = LD_RLD65NZX1: RLD65NZX1
R38-R44 = _RES_B_2: RES
TP13 TP18 TP19 = Test Point: Solder: NF

## Sheet MOUNTING.SchDoc
size 420 x 297 mm; SheetNumber: 7; SheetTotal: 7
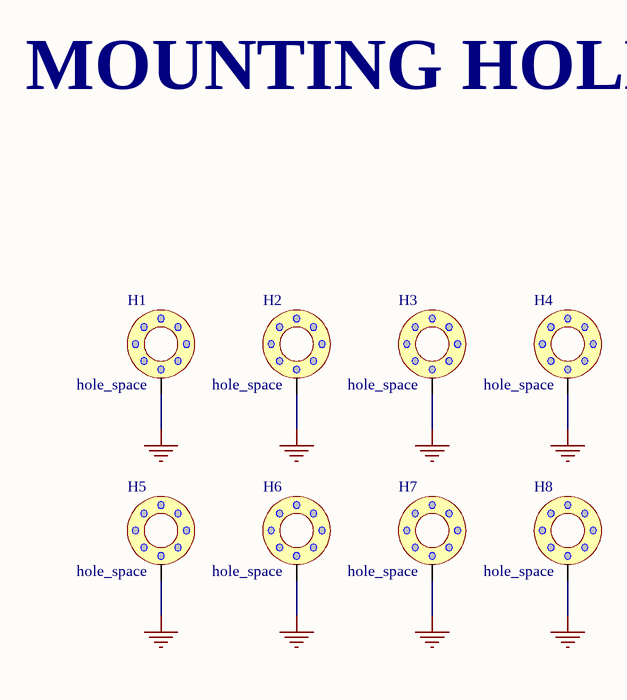
[diagram p8: MOUNTING.SchDoc]

### Parts
H1  hole_space  [HEX-M3_NoVia_Smaller]
H2  hole_space  [HEX-M3_NoVia_Smaller]
H3  hole_space  [HEX-M3_NoVia_Smaller]
H4  hole_space  [HEX-M3_NoVia_Smaller]
H5  hole_space  [HEX-M3_NoVia_Smaller]
H6  hole_space  [HEX-M3_NoVia_Smaller]
H7  hole_space  [HEX-M3_NoVia_Smaller]
H8  hole_space  [HEX-M3_NoVia_Smaller]

### Nets
GND: H1.1 H2.1 H3.1 H4.1 H5.1 H6.1 H7.1 H8.1

### Notes on the sheet
- MOUNTING HOLE
- Project:
- Sub-system:
- Design by:
- Sheet title:
- Sheet
- A3
- of
- Checked by:
- Approved by:
- Revision:
- Document No:
- Size:
- Date:

## Nets that join several sheets
3V3: 3_POWER SWITCH AND LDO (5 pins), 5_CURRENT_SOURCE (14 pins), 6_SWITCHING (7 pins)
12V_EXP: 3_POWER SWITCH AND LDO (5 pins), 4_COMMUNICATION (J1#2.1 J2.1 J3.01 J3.02), 5_CURRENT_SOURCE (12 pins), 6_SWITCHING (8 pins)
GND: 3_POWER SWITCH AND LDO (17 pins), 4_COMMUNICATION (17 pins), 5_CURRENT_SOURCE (22 pins), 6_SWITCHING (78 pins), MOUNTING (8 pins)
I_LD_EXT: 5_CURRENT_SOURCE (Q2.3), 6_SWITCHING (8 pins)
I_LD_INT: 5_CURRENT_SOURCE (Q1.3), 6_SWITCHING (24 pins)
DAC_CS: 4_COMMUNICATION (D7.2 J1#2.6 J3.11), 5_CURRENT_SOURCE (R8.2 U2.3)
EXT_LASER_DAC: 4_COMMUNICATION (D9.1 D9.2 J2.11 J3.22), 5_CURRENT_SOURCE (R28.1 U6.1)
EXT_LASER_DAC_LATCH: 4_COMMUNICATION (D34.1 J2.7 J3.14), 5_CURRENT_SOURCE (R47.1 U12.8)
EXT_LASER_DAC_nCS: 4_COMMUNICATION (D35.2 J2.6 J3.12), 5_CURRENT_SOURCE (R45.2 U12.3)
EXT_LASER_DAC_nCS1: 4_COMMUNICATION (D34.2 J2.9 J3.18), 6_SWITCHING (U3.24)
EXT_LASER_SPI_MOSI: 4_COMMUNICATION (D44.1 J2.3 J3.06), 5_CURRENT_SOURCE (U12.5), 6_SWITCHING (U3.3)
EXT_LASER_SPI_SCK: 4_COMMUNICATION (D35.1 J2.5 J3.10), 5_CURRENT_SOURCE (U12.4), 6_SWITCHING (U3.1)
I_MO_INT: 4_COMMUNICATION (D5.2 J1#2.10 J3.19), 5_CURRENT_SOURCE (R11.1 U4.1)
LATCH: 4_COMMUNICATION (D6.1 J1#2.7 J3.13), 5_CURRENT_SOURCE (R13.1 U2.8)
MOSI_LD: 4_COMMUNICATION (D8.1 J1#2.3 J3.05 TP2.1), 5_CURRENT_SOURCE (U2.5), 6_SWITCHING (U8.3)
SCK_LD: 4_COMMUNICATION (D7.1 J1#2.5 J3.09 TP4.1), 5_CURRENT_SOURCE (U2.4), 6_SWITCHING (U8.1 U9.1 U10.1)
SW_INT_CS: 4_COMMUNICATION (D6.2 J1#2.8 J3.15 TP5.1), 6_SWITCHING (U8.24 U9.24 U10.24)